# EAGLE design Flight Controller (EAGLE 8.0.0)

## Sheet 1 of 3: FC
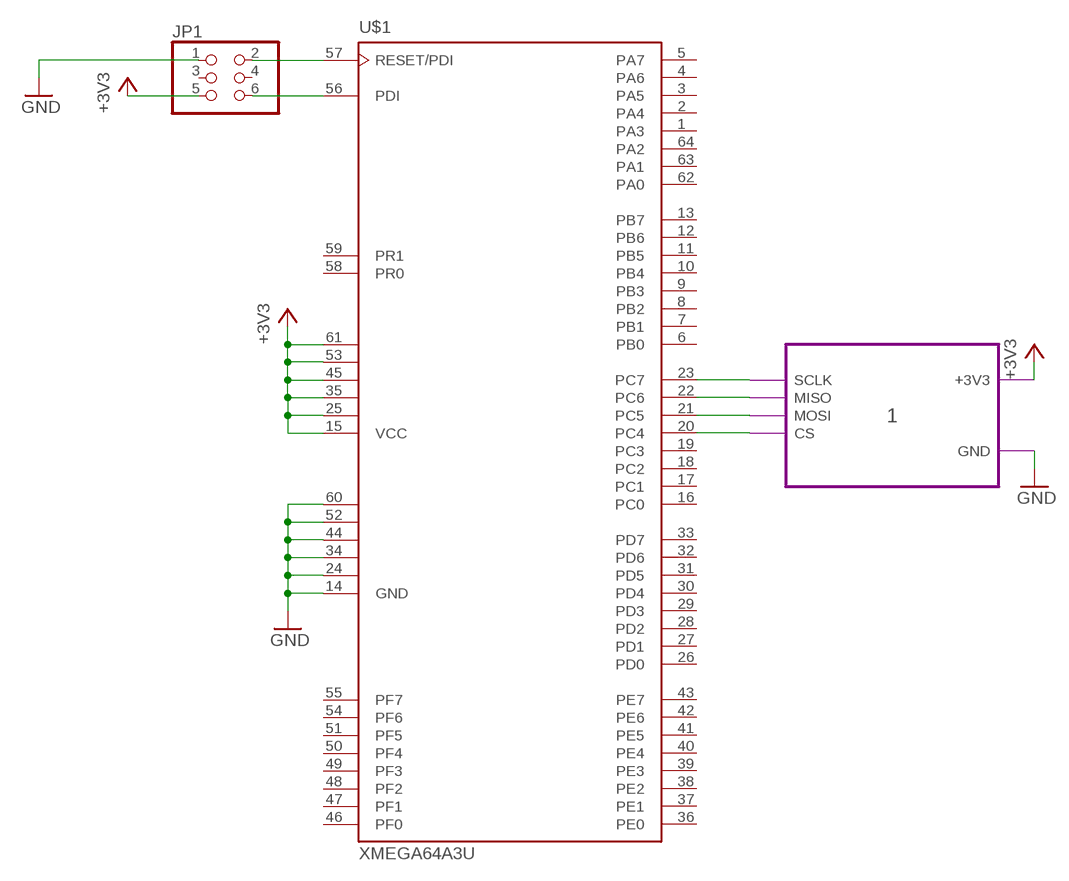
[diagram p0: schematic, sheet 1]

### Parts
JP1  PINHD-2X3  [2X03]
U$1  XMEGA64A3U  [TQFP64]

### Module instances
1 = M

### Nets
+3V3: JP1.5 U$1.15(VCC) U$1.25(VCC) U$1.35(VCC) U$1.45(VCC) U$1.53(VCC) U$1.61(VCC) ; port 1.+3V3
GND: JP1.1 U$1.14(GND) U$1.24(GND) U$1.34(GND) U$1.44(GND) U$1.52(GND) U$1.60(GND) ; port 1.GND
MS5611_CS: U$1.20(PC4) ; port 1.CS
MS5611_MISO: U$1.22(PC6) ; port 1.MISO
MS5611_MOSI: U$1.21(PC5) ; port 1.MOSI
MS5611_SCLK: U$1.23(PC7) ; port 1.SCLK
X_PDI_DATA: JP1.6 U$1.56(PDI)
X_RESET_PDI_CLK: JP1.2 U$1.57(RESET/PDI)
Unconnected: JP1.3 JP1.4 U$1.1(PA3) U$1.2(PA4) U$1.3(PA5) U$1.4(PA6) U$1.5(PA7) U$1.6(PB0) U$1.7(PB1) U$1.8(PB2) U$1.9(PB3) U$1.10(PB4) U$1.11(PB5) U$1.12(PB6) U$1.13(PB7) U$1.16(PC0) U$1.17(PC1) U$1.18(PC2) U$1.19(PC3) U$1.26(PD0) U$1.27(PD1) U$1.28(PD2) U$1.29(PD3) U$1.30(PD4) U$1.31(PD5) U$1.32(PD6) U$1.33(PD7) U$1.36(PE0) U$1.37(PE1) U$1.38(PE2) U$1.39(PE3) U$1.40(PE4) U$1.41(PE5) U$1.42(PE6) U$1.43(PE7) U$1.46(PF0) U$1.47(PF1) U$1.48(PF2) U$1.49(PF3) U$1.50(PF4) U$1.51(PF5) U$1.54(PF6) U$1.55(PF7) U$1.58(PR0) U$1.59(PR1) U$1.62(PA0) U$1.63(PA1) U$1.64(PA2)

## Sheet 2 of 3
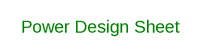
[diagram p1: schematic, sheet 2]

### Notes on the sheet
- Power Design Sheet

## Sheet 3 of 3
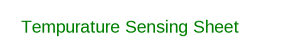
[diagram p2: schematic, sheet 3]

### Notes on the sheet
- Tempurature Sensing Sheet

## Library data of the parts
JP1 = pinhead:PINHD-2X3: PIN HEADER
U$1 = atmel:XMEGA64A3U

## Module M
Ports: SCLK(in) MISO(out) MOSI(in) CS(in) +3V3(in) GND(in)
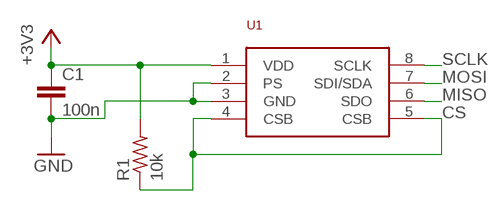
[diagram p3: schematic, module M, sheet 1]

### Parts
C1  100n  C-EUC0603  [C0603]
R1  10k  R-US_R0603  [R0603]
U1  MS5611  [MS5611]

### Nets
+3V3: C1.1 R1.2 U1.1(VDD)
CS: R1.1 U1.4(CSB) U1.5(CSB)
GND: C1.2 U1.2(PS) U1.3(GND)
MISO: U1.6(SDO)
MOSI: U1.7(SDI/SDA)
SCLK: U1.8(SCLK)

### Library data of the parts
C1 = resistor:C-EU: CAPACITOR, European symbol
R1 = rcl:R-US_: RESISTOR, American symbol
U1 = Measurement Specialties:MS5611: MS5611 Pressure Sensor from SEAS Switzerland.

## Module MPU9250
Ports: 
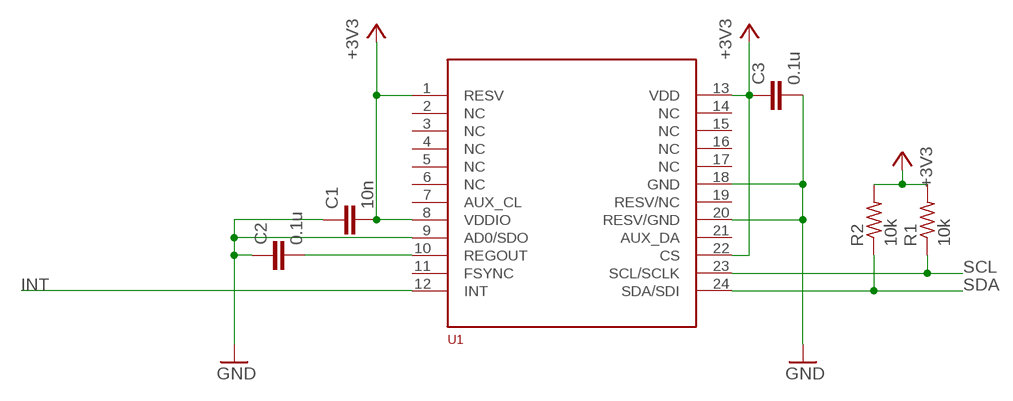
[diagram p4: schematic, module MPU9250, sheet 1]

### Parts
C1  10n  C-EUC0603  [C0603]
C2  0.1u  C-EUC0603  [C0603]
C3  0.1u  C-EUC0603  [C0603]
R1  10k  R-US_R0603  [R0603]
R2  10k  R-US_R0603  [R0603]
U1  MPU-9250  [QFN-24]

### Nets
+3V3: C1.2 C3.1 R1.2 R2.2 U1.1(RESV) U1.8(VDDIO) U1.13(VDD) U1.22(CS)
GND: C1.1 C2.1 C3.2 U1.9(AD0/SDO) U1.18(GND) U1.20(RESV/GND)
INT: U1.12(INT)
N$2: C2.2 U1.10(REGOUT)
SCL: R1.1 U1.23(SCL/SCLK)
SDA: R2.1 U1.24(SDA/SDI)
Unconnected: U1.2(NC) U1.3(NC) U1.4(NC) U1.5(NC) U1.6(NC) U1.7(AUX_CL) U1.11(FSYNC) U1.14(NC) U1.15(NC) U1.16(NC) U1.17(NC) U1.19(RESV/NC) U1.21(AUX_DA)

### Library data of the parts
C1-C3 = rcl:C-EU: CAPACITOR, European symbol
R1 R2 = rcl:R-US_: RESISTOR, American symbol
U1 = InvenSense:MPU-9250

## Module TEMP_SENSING
Ports: 

### Library data of the parts

## Module ORDANCE_FIRING
Ports: 

### Library data of the parts

## Net classes
0 default: clearance 0.205 mm

## Board
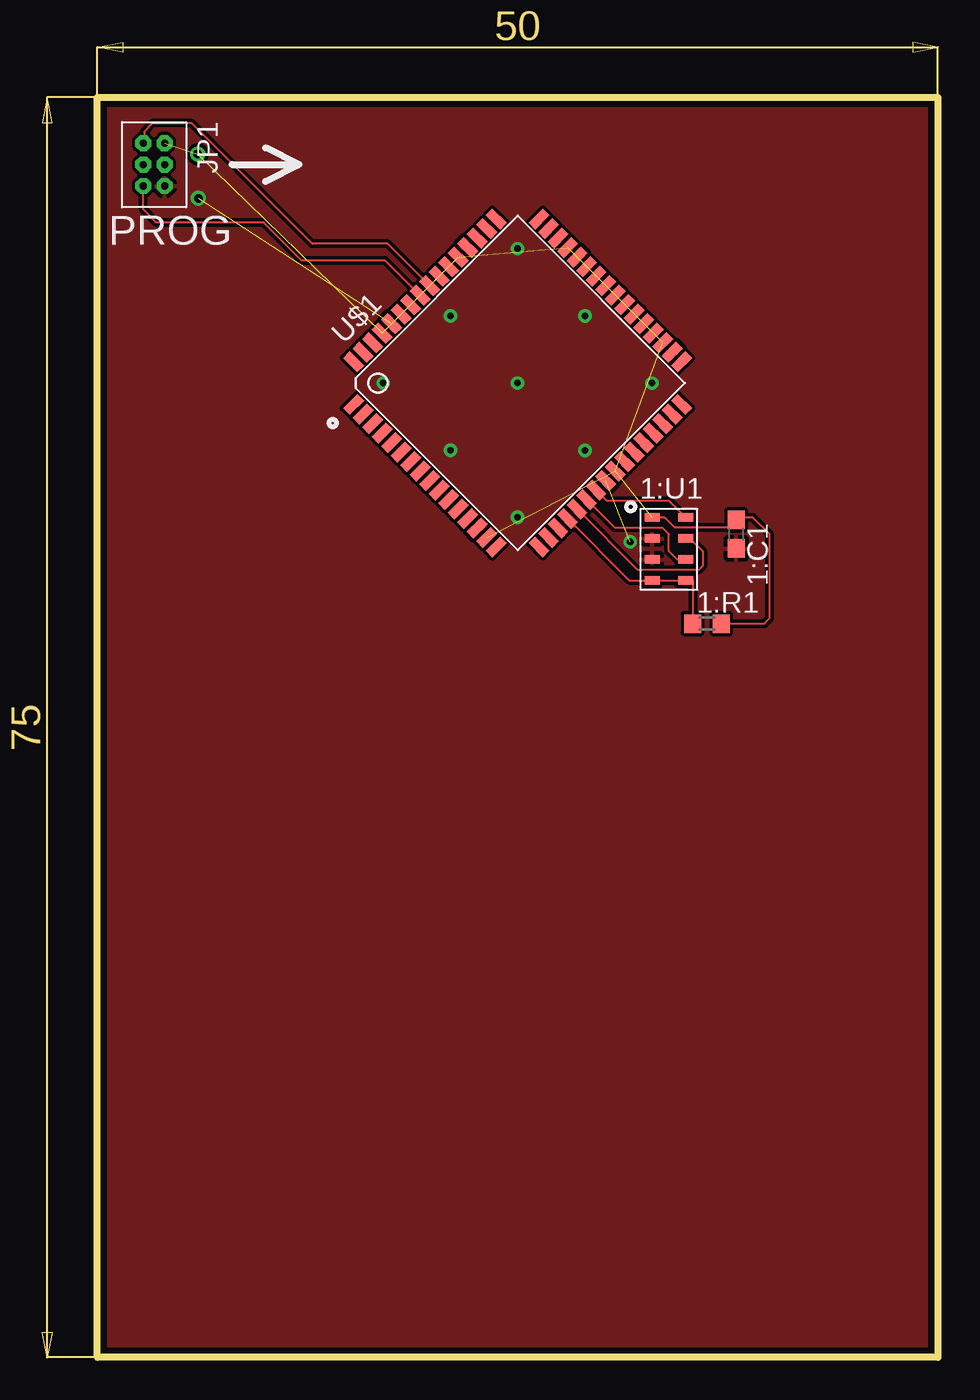
[diagram p5: board, top side]

Size 50 x 75 mm. Coordinates in mm from the lower left corner, seen from the top.
Outline: 0,75 50,75 50,0 0,0 0,75
Copper layers (1*16): Top 0.035559375mm / dielectric 1.501140625mm / Bottom 0.035559375mm
Design rules "4pcb_DesignRules *": minimum track width 5mil, minimum drill 15mil, track to track 5mil, track to pad 5mil, pad to pad 5mil, via to via 5mil, smd to smd 5mil, copper to edge 15mil, drill to drill 8mil, minimum pad ring 10mil, minimum via ring 8mil, stop-mask expansion 4mil, vias tented up to drill 0mil, thermal gap 10mil

### Footprints (pad centres in the part's own frame; a part is rotated, then mirrored left to right if it is on the bottom)
C0603 = smd 1.1 x 1: 1 -0.85,0; 2 0.85,0
R0603 = smd 1 x 1.1: 1 -0.85,0; 2 0.85,0
MS5611 = smd 0.9 x 0.5: 1 0,0; 2 0,-1.25; 3 0,-2.5; 4 0,-3.75; 5 2,-3.75; 6 2,-2.5; 7 2,-1.25; 8 2,0
2X03 = drill 0.432 octagon: 1 0,1.27; 2 1.27,1.27; 3 0,0; 4 1.27,0; 5 0,-1.27; 6 1.27,-1.27
TQFP64 = smd 1.194 x 0.559: 1 -7.8,6; 2 -7.8,5.2; 3 -7.8,4.4; 4 -7.8,3.6; 5 -7.8,2.8; 6 -7.8,2; 7 -7.8,1.2; 8 -7.8,0.4; 9 -7.8,-0.4; 10 -7.8,-1.2; 11 -7.8,-2; 12 -7.8,-2.8; 13 -7.8,-3.6; 14 -7.8,-4.4; 15 -7.8,-5.2; 16 -7.8,-6; 33 7.8,-6; 34 7.8,-5.2; 35 7.8,-4.4; 36 7.8,-3.6; 37 7.8,-2.8; 38 7.8,-2; 39 7.8,-1.2; 40 7.8,-0.4; 41 7.8,0.4; 42 7.8,1.2; 43 7.8,2; 44 7.8,2.8; 45 7.8,3.6; 46 7.8,4.4; 47 7.8,5.2; 48 7.8,6 | smd 0.559 x 1.194: 17 -6,-7.8; 18 -5.2,-7.8; 19 -4.4,-7.8; 20 -3.6,-7.8; 21 -2.8,-7.8; 22 -2,-7.8; 23 -1.2,-7.8; 24 -0.4,-7.8; 25 0.4,-7.8; 26 1.2,-7.8; 27 2,-7.8; 28 2.8,-7.8; 29 3.6,-7.8; 30 4.4,-7.8; 31 5.2,-7.8; 32 6,-7.8; 49 6,7.8; 50 5.2,7.8; 51 4.4,7.8; 52 3.6,7.8; 53 2.8,7.8; 54 2,7.8; 55 1.2,7.8; 56 0.4,7.8; 57 -0.4,7.8; 58 -1.2,7.8; 59 -2,7.8; 60 -2.8,7.8; 61 -3.6,7.8; 62 -4.4,7.8; 63 -5.2,7.8; 64 -6,7.8

### Placement (x,y rotation side)
1:C1  100n  [C0603]  38,49 270 top
1:R1  10k  [R0603]  36.26,43.68 0 top
1:U1  [MS5611]  33,50 0 top
JP1  4,71 180 top
U$1  25,58 45 top

### Tracks (layer width: path | path; a pad name or v marks a point on that pad's centre or on a via)
+3V3  (via drill 0.5)  (8 unrouted)
  Top 0.13: 1:U1.1 33.75,49.99 34.34,49.4 37.56,49.41 1:C1.1 38.15,50 39,50 40,49 40,44 39.68,43.68 1:R1.2
  other vias: 5.96,71.63
GND  (via drill 0.39, 0.5)  (2 unrouted)
  other vias: 6,69 21,62 17,58 25,58 29,54 29,62 21,62 25,66 33,58 21,54 25,50 31.7,48.54
  pour Top (isolate 0.1): 0,75 50,75 50,0 0,0
MS5611_CS
  Top 0.13: U$1.20 31.65,46.25 1:U1.4 1:U1.5 35.41,46.25 1:R1.1
  Top 0.254: U$1.20
MS5611_MISO
  Top 0.13: 1:U1.6 34.5,47.5 34,48 34,49 33.63,49.37 30.8,49.37 U$1.22
MS5611_MOSI
  Top 0.13: 1:U1.7 35.25,48.75 36,48 36,47.11 35.77,46.88 32.16,46.88 U$1.21
MS5611_SCLK
  Top 0.13: U$1.23 30.3,51 34,51 1:U1.8
  Top 0.254: U$1.23 29.67,51.62
X_PDI_DATA
  Top 0.13: U$1.56 17.28,66.29 12.79,66.29 5.62,73.46 3.27,73.46 2.77,72.96 2.77,72.31 JP1.6
X_RESET_PDI_CLK
  Top 0.13: U$1.57 19.19,63.23 17.12,65.3 12.16,65.3 9.9,67.56 3.51,67.56 2.73,68.34 JP1.2

### Text on the board
tPlace: PROG